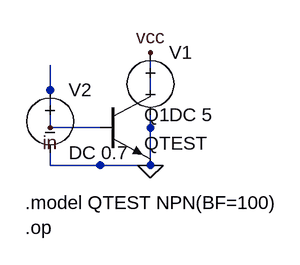
[diagram p0: schematic ltspice_bjt.asc]
ltspice_bjt.asc, the LTspice schematic file:
Version 4
SHEET 1 880 680
WIRE 0 16 0 96
WIRE 64 96 0 96
WIRE 128 0 128 48
WIRE 128 144 128 96
WIRE 64 144 128 144
WIRE 128 80 128 144
WIRE 0 128 0 144
WIRE 0 144 128 144
FLAG 0 96 in
FLAG 128 0 vcc
FLAG 128 144 0
SYMBOL voltage 128 -16 R0
SYMATTR InstName V1
SYMATTR Value DC 5
SYMBOL voltage 0 32 R0
SYMATTR InstName V2
SYMATTR Value DC 0.7
SYMBOL npn 64 48 R0
SYMATTR InstName Q1
SYMATTR Value QTEST
TEXT -32 192 Left 2 !.model QTEST NPN(BF=100)
TEXT -32 224 Left 2 !.op

The netlist it stands for:
* ltspice_bjt.asc
V1 vcc 0 DC 5
V2 in 0 DC 0.7
Q1 vcc in 0 0 QTEST
.model NPN NPN
.model PNP PNP
.lib standard.bjt
.model QTEST NPN(BF=100)
.op
.backanno
.end